# Altium project gameConsole.PrjPcb
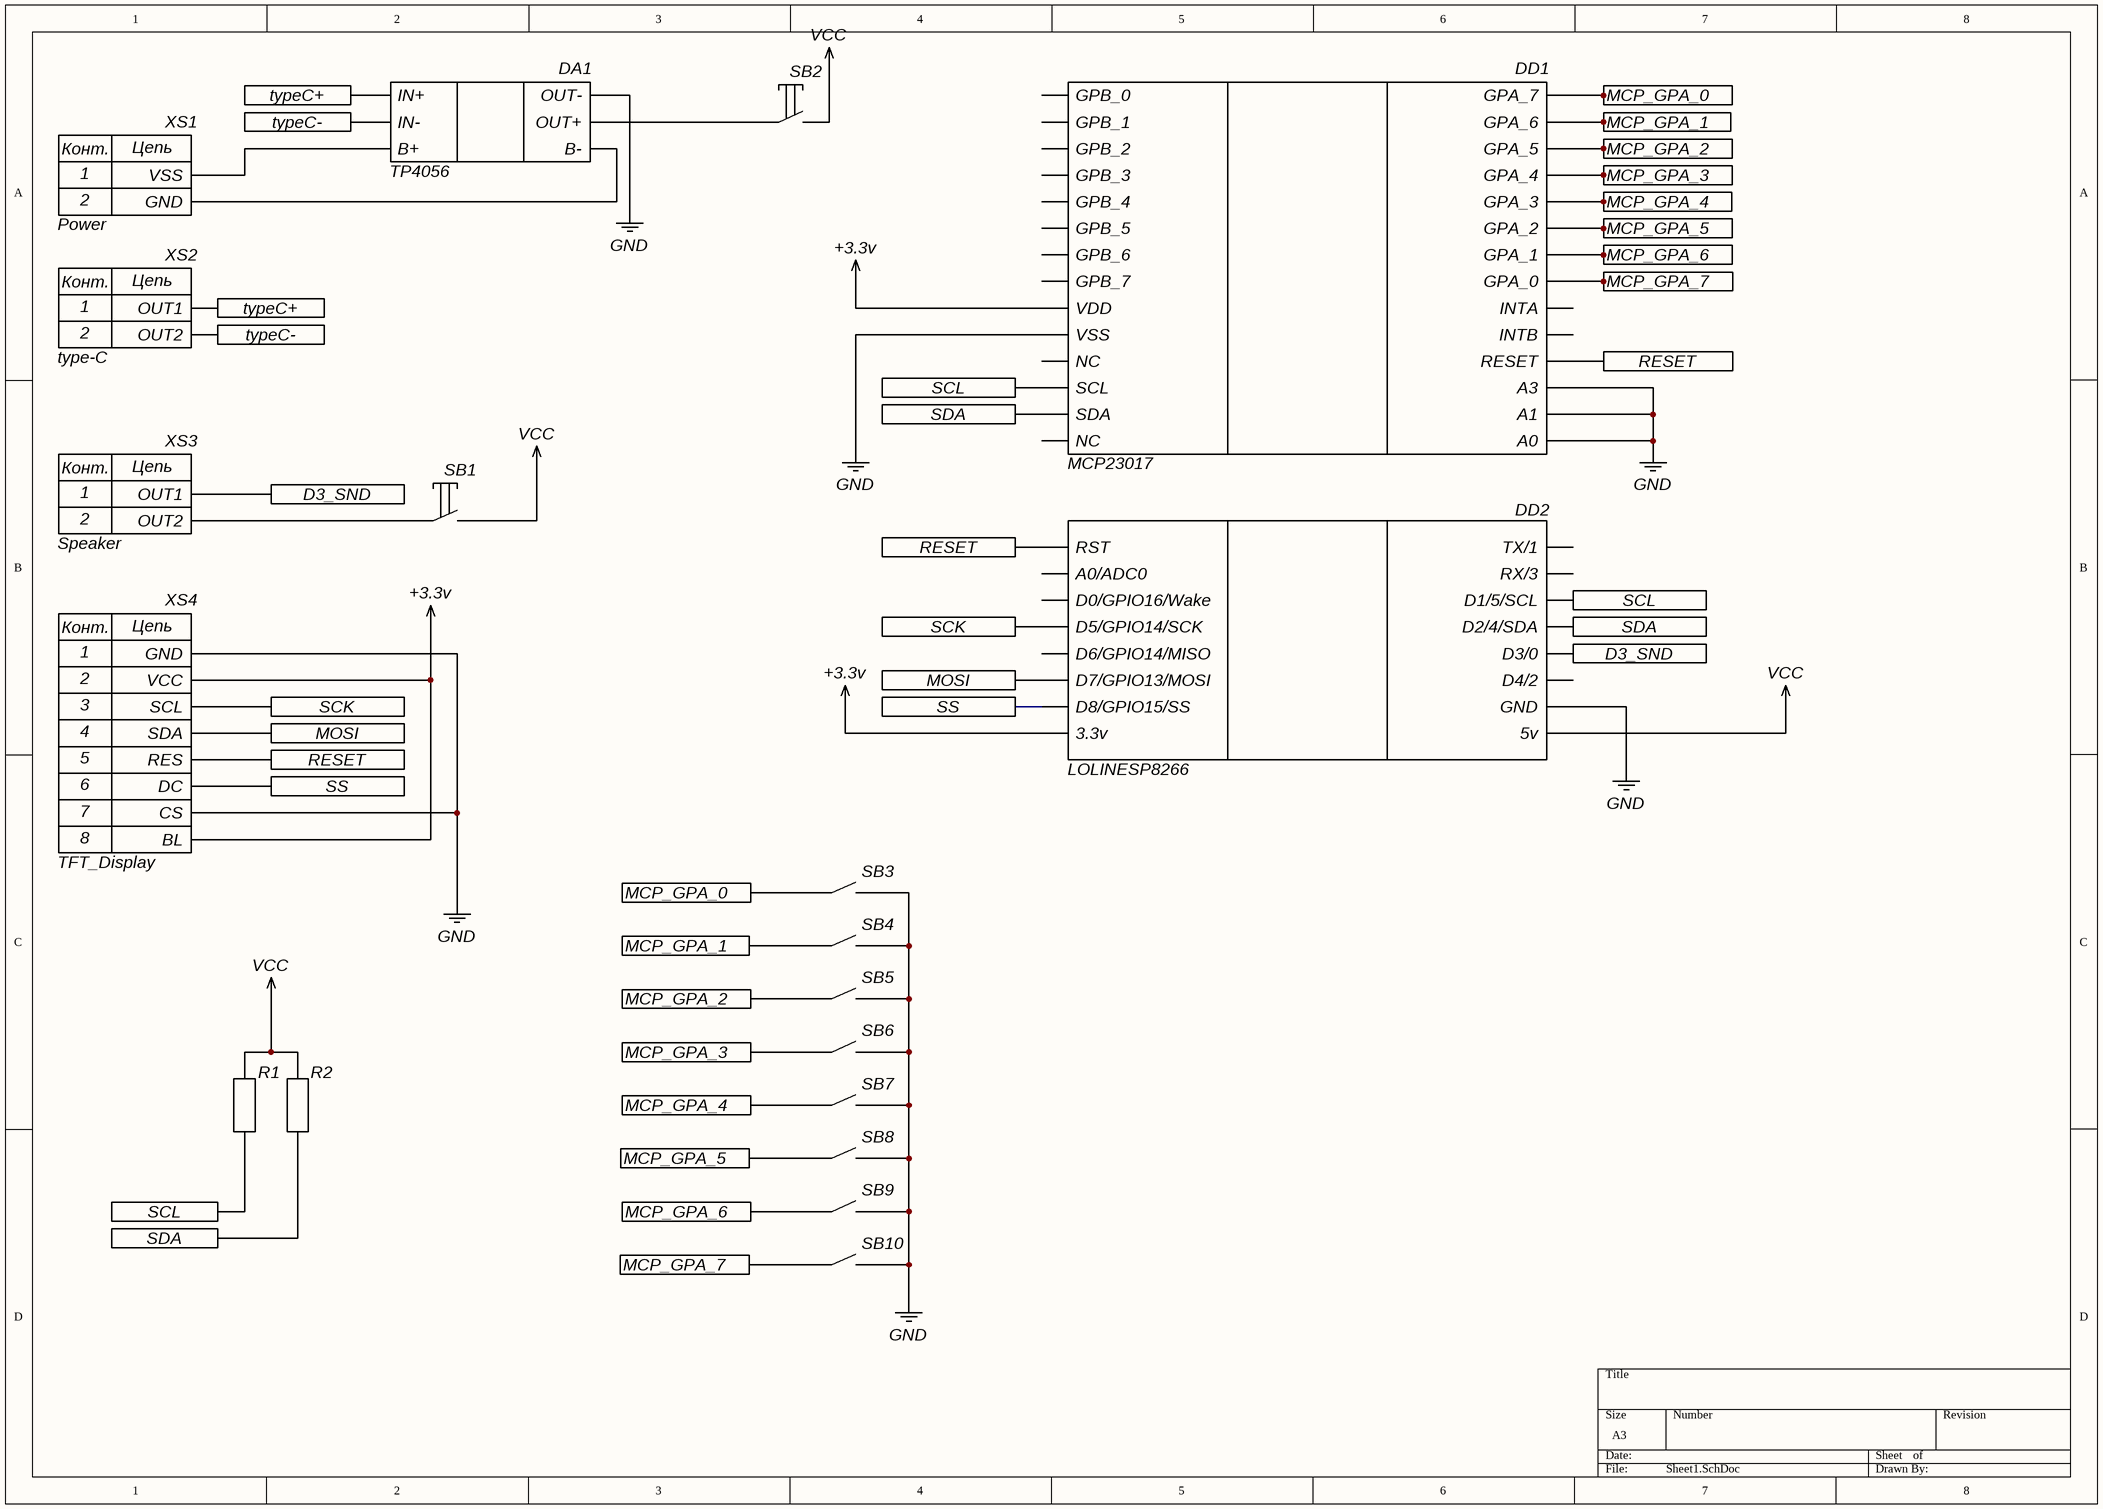
[diagram p0: Sheet1.SchDoc]
1 sheet, 19 parts. Net scope: flat (ports and power ports of the same name join across sheets).
Board file: PCB1.PcbDoc

## Sheet Sheet1.SchDoc
size A3; SheetNumber: 1; SheetTotal: 1

### Parts
DA1  TP4056  [1S 4056 BMS USB C]
DD1  MCP23017  [DIP28]
DD2  LOLINESP8266  [ESP8266Wemos]
R1  resistor  [res]  (value not drawn)
R2  resistor  [res]  (value not drawn)
SB1  button2  [On/Off]  (value not drawn)
SB2  button2  [On/Off]  (value not drawn)
SB3  button  [button]  (value not drawn)
SB4  button  [button]  (value not drawn)
SB5  button  [button]  (value not drawn)
SB6  button  [button]  (value not drawn)
SB7  button  [button]  (value not drawn)
SB8  button  [button]  (value not drawn)
SB9  button  [button]  (value not drawn)
SB10  button  [button]  (value not drawn)
XS1  Power  [Power]
XS2  type-C  [2pin]
XS3  Speaker  [2pin]
XS4  TFT_Display  [TFT]

### Ports
D3_SND (see Sheet1[2B]), D3_SND (see Sheet1[6B]), MCP_GPA_0 (see Sheet1[3C]), MCP_GPA_0 (see Sheet1[7A]), MCP_GPA_1 (see Sheet1[3C]), MCP_GPA_1 (see Sheet1[7A]), MCP_GPA_2 (see Sheet1[3C]), MCP_GPA_2 (see Sheet1[7A]), MCP_GPA_3 (see Sheet1[3C]), MCP_GPA_3 (see Sheet1[7A]), MCP_GPA_4 (see Sheet1[3C]), MCP_GPA_4 (see Sheet1[7A]), MCP_GPA_5 (see Sheet1[3D]), MCP_GPA_5 (see Sheet1[7A]), MCP_GPA_6 (see Sheet1[3D]), MCP_GPA_6 (see Sheet1[7A]), MCP_GPA_7 (see Sheet1[3D]), MCP_GPA_7 (see Sheet1[7A]), MOSI (see Sheet1[2B]), MOSI (see Sheet1[4B]), RESET (see Sheet1[2C], Sheet1[4B]), RESET (see Sheet1[2C], Sheet1[7A]), RESET (see Sheet1[4B], Sheet1[7A]), SCK (see Sheet1[2B]), SCK (see Sheet1[4B]), SCL (see Sheet1[1D], Sheet1[4B]), SCL (see Sheet1[1D], Sheet1[6B]), SCL (see Sheet1[4B], Sheet1[6B]), SDA (see Sheet1[1D], Sheet1[4B]), SDA (see Sheet1[1D], Sheet1[6B]), SDA (see Sheet1[4B], Sheet1[6B]), SS (see Sheet1[2C]), SS (see Sheet1[4B]), typeC+ (see Sheet1[1A]), typeC- (see Sheet1[1A])

### Nets
+3.3v: DD1.9(VDD) DD2.8(3.3v) XS4.2(VCC) XS4.8(BL)
GND: DA1.6(OUT-) DD1.10(VSS) DD1.15(A0) DD1.16(A1) DD1.17(A3) DD2.16(GND) SB3.2 SB4.2 SB5.2 SB6.2 SB7.2 SB8.2 SB9.2 SB10.2 XS4.1(GND) XS4.7(CS)
VCC: DD2.15(5v) R1.1 R2.1 SB1.2 SB2.2
NetDA1_1: DA1.1(IN+) XS2.1(OUT1) ; port typeC+
NetDA1_2: DA1.2(IN-) XS2.2(OUT2) ; port typeC-
NetDA1_3: DA1.3(B+) XS1.1(VSS)
NetDA1_4: DA1.4(B-) XS1.2(GND)
NetDA1_5: DA1.5(OUT+) SB2.1
NetDD1_12: DD1.12(SCL) DD2.20(D1/5/SCL) R1.2 ; port SCL
NetDD1_13: DD1.13(SDA) DD2.19(D2/4/SDA) R2.2 ; port SDA
NetDD1_18: DD1.18(RESET) DD2.1(RST) XS4.5(RES) ; port RESET
NetDD1_21: DD1.21(GPA_0) SB10.1 ; port MCP_GPA_7
NetDD1_22: DD1.22(GPA_1) SB9.1 ; port MCP_GPA_6
NetDD1_23: DD1.23(GPA_2) SB8.1 ; port MCP_GPA_5
NetDD1_24: DD1.24(GPA_3) SB7.1 ; port MCP_GPA_4
NetDD1_25: DD1.25(GPA_4) SB6.1 ; port MCP_GPA_3
NetDD1_26: DD1.26(GPA_5) SB5.1 ; port MCP_GPA_2
NetDD1_27: DD1.27(GPA_6) SB4.1 ; port MCP_GPA_1
NetDD1_28: DD1.28(GPA_7) SB3.1 ; port MCP_GPA_0
NetDD2_4: DD2.4(D5/GPIO14/SCK) XS4.3(SCL) ; port SCK
NetDD2_6: DD2.6(D7/GPIO13/MOSI) XS4.4(SDA) ; port MOSI
NetDD2_7: DD2.7(D8/GPIO15/SS) XS4.6(DC) ; port SS
NetDD2_18: DD2.18(D3/0) XS3.1(OUT1) ; port D3_SND
NetSB1_1: SB1.1 XS3.2(OUT2)

Not connected (* = marked no-connect by the designer): DD1 1(GPB_0) 2(GPB_1) 3(GPB_2) 4(GPB_3) 5(GPB_4) 6(GPB_5) 7(GPB_6) 8(GPB_7) 11(NC) 14(NC) 19(INTB) 20(INTA); DD2 2(A0/ADC0) 3(D0/GPIO16/Wake) 5(D6/GPIO14/MISO) 17(D4/2) 21(RX/3) 22(TX/1)

### Notes on the sheet
- (in symbol Power) Конт.; Цепь

### Library data of the parts
XS2 XS3 = pinOutX2